# Altium project LM2596 Ayarlanabilir Buck Converter.PrjPcb
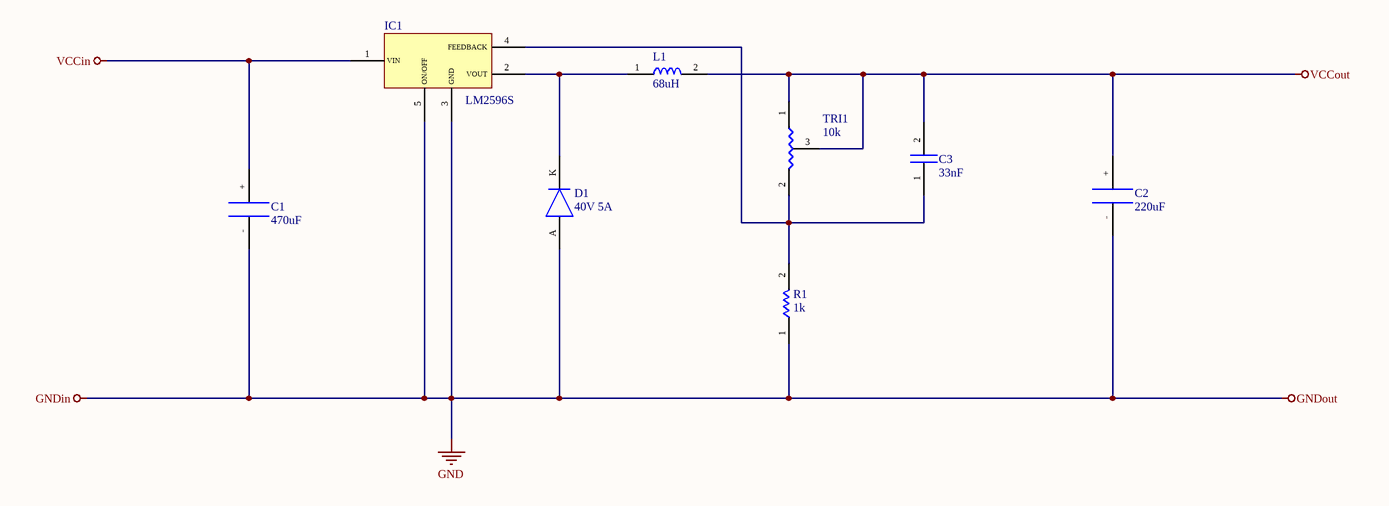
[diagram p0: LM2596 Ayarlanabilir Buck Converter Şematik.SchDoc]
1 sheet, 8 parts. Net scope: global (net labels, ports and power ports of the same name join across sheets).
Board file: LM2596 Ayarlanabilir Buck Converter PCB.PcbDoc

## Sheet LM2596 Ayarlanabilir Buck Converter Şematik.SchDoc
size A4; SheetNumber: 1; SheetTotal: 1

### Parts
C1  470uF  [470uF 50V Elektrolikit Kapasitör]
C2  220uF  [220uF 35V Elektrolikit Kapasitör]
C3  33nF  [33nF Kapasitör]
D1  40V 5A  [40V 5A Schottky Diyot]
IC1  LM2596S  [LM2596S]
L1  68uH  [68uH İndüktör]
R1  1k  [10k SMD Direnç]
TRI1  10k  [Düzenleyici Potansiyometre]

### Nets
GND: C1.- C2.- D1.A IC1.3(GND) IC1.5(ON/OFF) R1.1  [also labelled GNDin, GNDout]
VCCin: C1.+ IC1.1(VIN)
VCCout: C2.+ C3.2 L1.2 TRI1.1 TRI1.3
NetC3_1: C3.1 IC1.4(FEEDBACK) R1.2 TRI1.2
NetD1_K: D1.K IC1.2(VOUT) L1.1

### Library data of the parts
C1 = 470uF 50V Elektrolikit Kapasitör
C2 = 220uF 35V Elektrolikit Kapasitör
C3 = 33nF Kapasitör
D1 = 40V 5A Schottky Diyot
L1 = 68uH İndüktör
R1 = 10k SMD Direnç
TRI1 = Düzenleyici Potansiyometre